# EAGLE design Light-ControllerV3.15 (EAGLE 7.6.0)
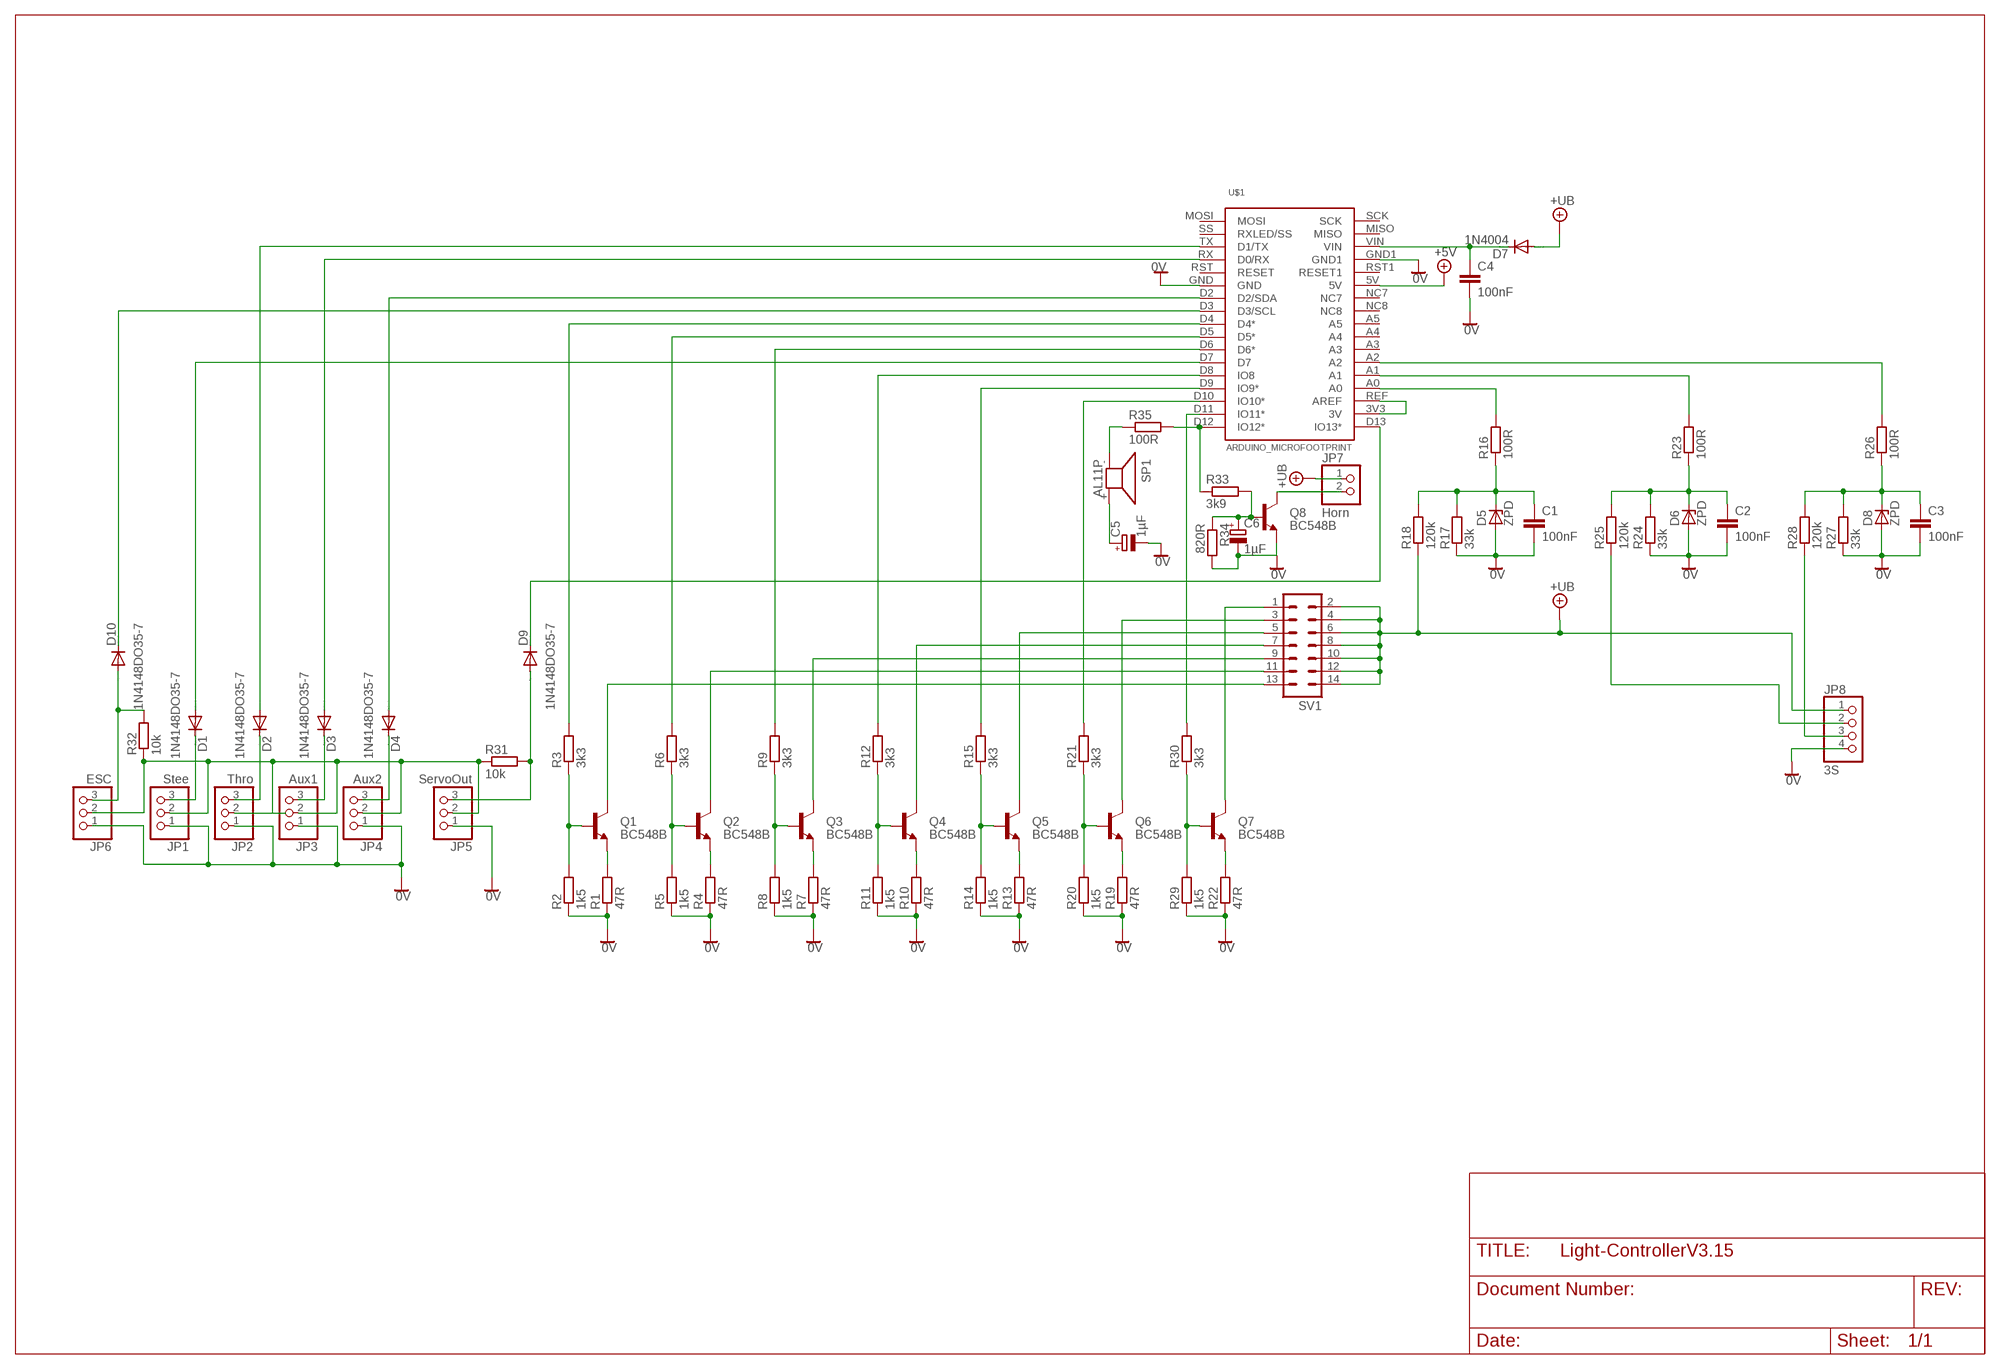
[diagram p0: schematic, sheet 1]

## Parts
C1  100nF  C-EU050-024X044  [C050-024X044]
C2  100nF  C-EU050-024X044  [C050-024X044]
C3  100nF  C-EU050-024X044  [C050-024X044]
C4  100nF  C-EU050-024X044  [C050-024X044]
C5  1µF  CPOL-EUE5-4  [E5-4]
C6  1µF  CPOL-EUE2.5-5  [E2,5-5]
D1  1N4148DO35-7  [DO35-7]
D2  1N4148DO35-7  [DO35-7]
D3  1N4148DO35-7  [DO35-7]
D4  1N4148DO35-7  [DO35-7]
D5  ZPD  [DO35Z10]
D6  ZPD  [DO35Z10]
D7  1N4004  [DO41-10]
D8  ZPD  [DO35Z10]
D9  1N4148DO35-7  [DO35-7]
D10  1N4148DO35-7  [DO35-7]
JP1  Stee  PINHD-1X3  [1X03]
JP2  Thro  PINHD-1X3  [1X03]
JP3  Aux1  PINHD-1X3  [1X03]
JP4  Aux2  PINHD-1X3  [1X03]
JP5  ServoOut  PINHD-1X3  [1X03]
JP6  ESC  PINHD-1X3  [1X03]
JP7  Horn  PINHD-1X2  [1X02]
JP8  3S  PINHD-1X4  [1X04]
Q1  BC548B  [TO92-EBC]
Q2  BC548B  [TO92-EBC]
Q3  BC548B  [TO92-EBC]
Q4  BC548B  [TO92-EBC]
Q5  BC548B  [TO92-EBC]
Q6  BC548B  [TO92-EBC]
Q7  BC548B  [TO92-EBC]
Q8  BC548B  [TO92-EBC]
R1  47R  R-EU_0204/2V  [0204V]
R2  1k5  R-EU_0204/2V  [0204V]
R3  3k3  R-EU_0204/2V  [0204V]
R4  47R  R-EU_0204/2V  [0204V]
R5  1k5  R-EU_0204/2V  [0204V]
R6  3k3  R-EU_0204/2V  [0204V]
R7  47R  R-EU_0204/2V  [0204V]
R8  1k5  R-EU_0204/2V  [0204V]
R9  3k3  R-EU_0204/2V  [0204V]
R10  47R  R-EU_0204/2V  [0204V]
R11  1k5  R-EU_0204/2V  [0204V]
R12  3k3  R-EU_0204/2V  [0204V]
R13  47R  R-EU_0204/2V  [0204V]
R14  1k5  R-EU_0204/2V  [0204V]
R15  3k3  R-EU_0204/2V  [0204V]
R16  100R  R-EU_0204/7  [0204/7]
R17  33k  R-EU_0204/7  [0204/7]
R18  120k  R-EU_0204/7  [0204/7]
R19  47R  R-EU_0204/2V  [0204V]
R20  1k5  R-EU_0204/2V  [0204V]
R21  3k3  R-EU_0204/2V  [0204V]
R22  47R  R-EU_0204/2V  [0204V]
R23  100R  R-EU_0204/7  [0204/7]
R24  33k  R-EU_0204/7  [0204/7]
R25  120k  R-EU_0204/7  [0204/7]
R26  100R  R-EU_0204/7  [0204/7]
R27  33k  R-EU_0204/7  [0204/7]
R28  120k  R-EU_0204/7  [0204/7]
R29  1k5  R-EU_0204/2V  [0204V]
R30  3k3  R-EU_0204/2V  [0204V]
R31  10k  R-EU_0204/2V  [0204V]
R32  10k  R-EU_0204/2V  [0204V]
R33  3k9  R-EU_0204/7  [0204/7]
R34  820R  R-EU_0204/7  [0204/7]
R35  100R  R-EU_0204/7  [0204/7]
SP1  AL11P  [AL11P]
SV1  ML14  [ML14]
U$1  ARDUINO_MICROFOOTPRINT  [ARDUINO-MICRO]

## Nets
0V: C1.2 C2.2 C3.2 C4.2 C5.- C6.- D5.A D6.A D8.A JP1.1 JP2.1 JP3.1 JP4.1 JP5.1 JP6.1 JP8.4 Q8.E R1.1 R2.1 R4.1 R5.1 R7.1 R8.1 R10.1 R11.1 R13.1 R14.1 R17.1 R19.1 R20.1 R22.1 R24.1 R27.1 R29.1 R34.2 U$1.GND U$1.GND1
+5V: U$1.5V
+UB: D7.A JP7.1 JP8.1 R18.1 SV1.2 SV1.4 SV1.6 SV1.8 SV1.10 SV1.12 SV1.14
+UB1: JP8.2 R25.1
+UB2: JP8.3 R28.1
N$1: Q1.B R2.2 R3.1
N$2: D1.C JP1.3
N$3: Q1.E R1.2
N$4: Q2.B R5.2 R6.1
N$5: Q2.E R4.2
N$6: Q3.B R8.2 R9.1
N$7: Q3.E R7.2
N$8: Q4.B R11.2 R12.1
N$9: Q4.E R10.2
N$10: Q5.B R14.2 R15.1
N$11: Q5.E R13.2
N$12: Q1.C SV1.13
N$13: Q2.C SV1.11
N$14: Q3.C SV1.9
N$15: Q4.C SV1.7
N$16: Q5.C SV1.5
N$17: U$1.3V3(3V) U$1.REF(AREF)
N$18: D2.C JP2.3
N$19: D3.C JP3.3
N$20: D4.C JP4.3
N$21: D1.A U$1.D7
N$22: JP1.2 JP2.2 JP3.2 JP4.2 JP5.2 JP6.2 R31.1 R32.1
N$23: D2.A U$1.TX(D1/TX)
N$24: D3.A U$1.RX(D0/RX)
N$25: D4.A U$1.D2(D2/SDA)
N$26: R3.2 U$1.D4(D4*)
N$27: R6.2 U$1.D5(D5*)
N$28: R9.2 U$1.D6(D6*)
N$29: R12.2 U$1.D8(IO8)
N$30: R15.2 U$1.D9(IO9*)
N$31: R16.2 U$1.A0
N$32: C1.1 D5.C R16.1 R17.2 R18.2
N$33: Q6.B R20.2 R21.1
N$34: Q6.E R19.2
N$35: R21.2 U$1.D10(IO10*)
N$36: R30.2 U$1.D11(IO11*)
N$37: Q7.B R29.2 R30.1
N$38: Q7.E R22.2
N$39: R23.2 U$1.A1
N$40: C2.1 D6.C R23.1 R24.2 R25.2
N$41: Q6.C SV1.3
N$42: C4.1 D7.C U$1.VIN
N$43: Q7.C SV1.1
N$44: R26.2 U$1.A2
N$45: C3.1 D8.C R26.1 R27.2 R28.2
N$46: R33.1 R35.2 U$1.D12(IO12*)
N$47: D9.A JP5.3 R31.2
N$48: D9.C U$1.D13(IO13*)
N$49: D10.A JP6.3 R32.2
N$50: D10.C U$1.D3(D3/SCL)
N$51: C6.+ Q8.B R33.2 R34.1
N$52: JP7.2 Q8.C
N$53: R35.1 SP1.-
N$54: C5.+ SP1.+
Unconnected: U$1.A3 U$1.A4 U$1.A5 U$1.MISO U$1.MOSI U$1.NC7 U$1.NC8 U$1.RST1(RESET1) U$1.RST(RESET) U$1.SCK U$1.SS(RXLED/SS)

## Library data of the parts
C1-C4 = rcl:C-EU: CAPACITOR, European symbol
C5 C6 = rcl:CPOL-EU: POLARIZED CAPACITOR, European symbol
D1-D4 D9 D10 = diode:1N4148: DIODE high speed (Philips)
D5 D6 D8 = diode:ZPD: Z DIODE 500 mW
D7 = diode:1N4004: DIODE general purpose rectifier, 1 A
JP1-JP6 = pinhead:PINHD-1X3: PIN HEADER
JP7 = pinhead:PINHD-1X2: PIN HEADER
JP8 = pinhead:PINHD-1X4: PIN HEADER
Q1-Q8 = transistor-npn:BC548*: NPN Transistor
R1-R35 = rcl:R-EU_: RESISTOR, European symbol
SP1 = buzzer:AL11P: SPEAKER Source: Buerklin; OC_FARNELL: unknown; OC_NEWARK: unknown
SV1 = con-harting-ml:ML14: HARTING; OC_FARNELL: unknown; OC_NEWARK: unknown
U$1 = arduino-micro:ARDUINO_MICRO

## Board
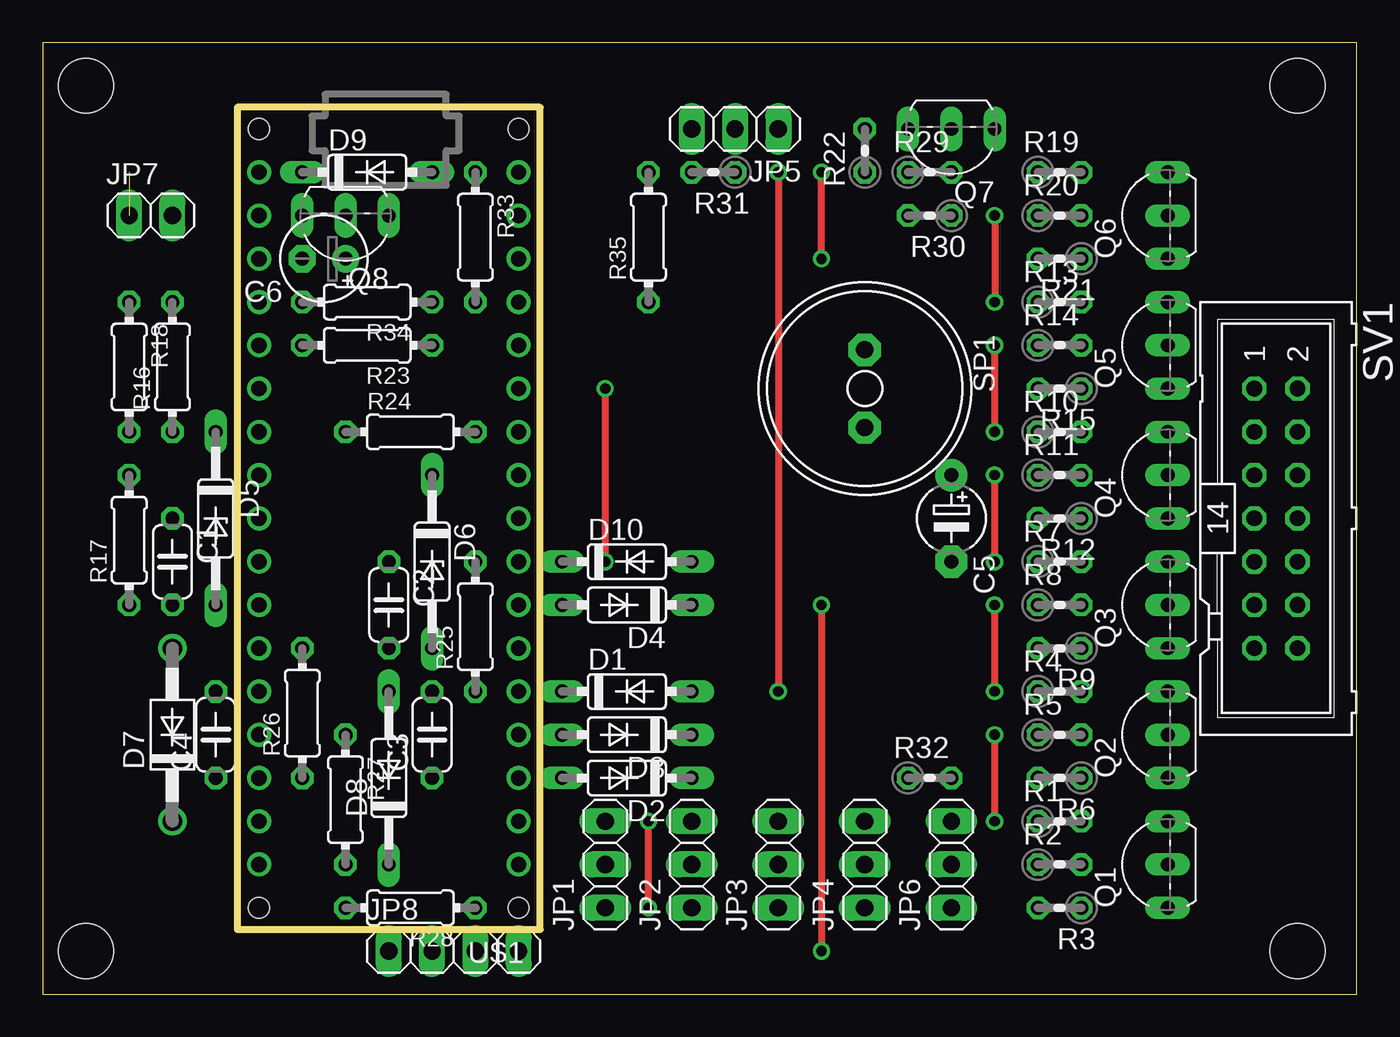
[diagram p1: board, top side]
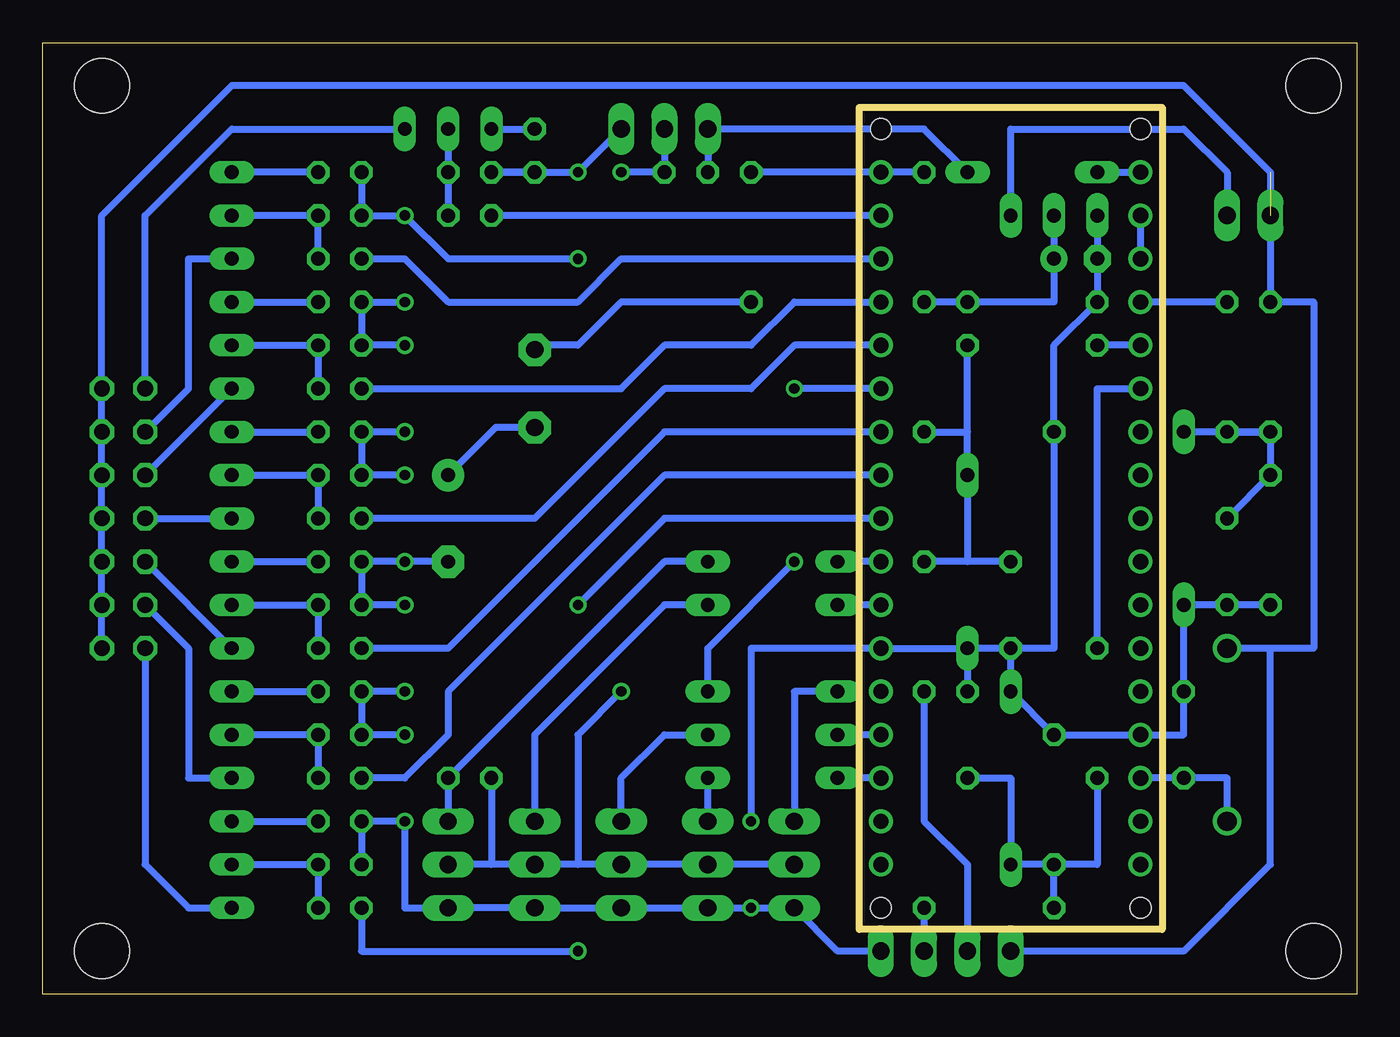
[diagram p2: board, bottom side, seen from below]

Size 77.14 x 55.87 mm. Coordinates in mm from the lower left corner, seen from the top.
Outline: 0,0 77.14,0 77.14,55.87 0,55.87 0,0
Copper layers (1*16): Top 0.035mm / dielectric 1.5mm / Bottom 0.035mm
Design rules "default": minimum track width 10mil, minimum drill 24mil, track to track 8mil, track to pad 8mil, pad to pad 8mil, via to via 8mil, smd to smd 8mil, copper to edge 40mil, drill to drill 8mil, minimum pad ring 10mil, minimum via ring 8mil, stop-mask expansion 4mil, vias tented up to drill 0mil, thermal gap 10mil
Holes 3.2 mm at 2.54,53.34 73.66,53.34 2.54,2.54 73.66,2.54

### Footprints (pad centres in the part's own frame; a part is rotated, then mirrored left to right if it is on the bottom)
C050-024X044 = drill 0.813 octagon: 1 -2.54,0; 2 2.54,0
E5-4 = drill 0.813 pad 1.905: + -2.54,0 | drill 0.813 pad 1.905 octagon: - 2.54,0
E2,5-5 = drill 0.813 pad 1.6: + -1.27,0 | drill 0.813 pad 1.6 octagon: - 1.27,0
DO35-7 = drill 0.813 long: A 3.81,0; C -3.81,0
DO35Z10 = drill 0.813 long: A 5.08,0; C -5.08,0
DO41-10 = drill 1.118: A 5.08,0; C -5.08,0
1X03 = drill 1.016 long: 1 -2.54,0; 2 0,0; 3 2.54,0
1X02 = drill 1.016 long: 1 -1.27,0; 2 1.27,0
1X04 = drill 1.016 long: 1 -3.81,0; 2 -1.27,0; 3 1.27,0; 4 3.81,0
TO92-EBC = drill 0.813 long: B 0,-1.27; C -2.54,-1.27; E 2.54,-1.27
0204V = drill 0.813 octagon: 1 -1.27,0; 2 1.27,0
0204/7 = drill 0.813 octagon: 1 -3.81,0; 2 3.81,0
AL11P = drill 1.016 pad 1.905 octagon: + 2.286,0; - -2.286,0
ML14 = drill 0.914 octagon: 1 -7.62,-1.27; 2 -7.62,1.27; 3 -5.08,-1.27; 4 -5.08,1.27; 5 -2.54,-1.27; 6 -2.54,1.27; 7 0,-1.27; 8 0,1.27; 9 2.54,-1.27; 10 2.54,1.27; 11 5.08,-1.27; 12 5.08,1.27; 13 7.62,-1.27; 14 7.62,1.27
ARDUINO-MICRO = drill 0.9: 3V3 16.51,3.81; 5V 16.51,29.21; A0 16.51,8.89; A1 16.51,11.43; A2 16.51,13.97; A3 16.51,16.51; A4 16.51,19.05; A5 16.51,21.59; D2 1.27,26.67; D3 1.27,24.13; D4 1.27,21.59; D5 1.27,19.05; D6 1.27,16.51; D7 1.27,13.97; D8 1.27,11.43; D9 1.27,8.89; D10 1.27,6.35; D11 1.27,3.81; D12 1.27,1.27; D13 16.51,1.27; GND 1.27,29.21; GND1 16.51,34.29; MISO 16.51,39.37; MOSI 1.27,41.91; NC7 16.51,26.67; NC8 16.51,24.13; REF 16.51,6.35; RST 1.27,31.75; RST1 16.51,31.75; RX 1.27,34.29; SCK 16.51,41.91; SS 1.27,39.37; TX 1.27,36.83; VIN 16.51,36.83 | hole 1.2: 1.27,-1.27; 16.51,-1.27; 1.27,44.45; 16.51,44.45

### Placement (x,y rotation side)
C1  7.62,25.4 270 top
C2  20.32,22.86 270 top
C3  22.86,15.24 90 top
C4  10.16,15.24 90 top
C5  53.34,27.94 270 top
C6  16.51,43.18 180 top
D1  34.29,17.78 0 top
D2  34.29,12.7 180 top
D3  34.29,15.24 180 top
D4  34.29,22.86 180 top
D5  10.16,27.94 270 top
D6  22.86,25.4 270 top
D7  7.62,15.24 90 top
D8  20.32,12.7 90 top
D9  19.05,48.26 0 top
D10  34.29,25.4 0 top
JP1  33.02,7.62 90 top
JP2  38.1,7.62 90 top
JP3  43.18,7.62 90 top
JP4  48.26,7.62 90 top
JP5  40.64,50.8 180 top
JP6  ESCout  [1X03]  53.34,7.62 90 top
JP7  6.35,45.72 0 top
JP8  24.13,2.54 0 top
Q1  64.77,7.62 90 top
Q2  64.77,15.24 90 top
Q3  64.77,22.86 90 top
Q4  64.77,30.48 90 top
Q5  64.77,38.1 90 top
Q6  64.77,45.72 90 top
Q7  53.34,49.53 180 top
Q8  17.78,44.45 180 top
R1  59.69,10.16 0 top
R2  59.69,7.62 0 top
R3  59.69,5.08 180 top
R4  59.69,17.78 0 top
R5  59.69,15.24 0 top
R6  59.69,12.7 180 top
R7  59.69,25.4 0 top
R8  59.69,22.86 0 top
R9  59.69,20.32 180 top
R10  59.69,33.02 0 top
R11  59.69,30.48 0 top
R12  59.69,27.94 180 top
R13  59.69,40.64 0 top
R14  59.69,38.1 0 top
R15  59.69,35.56 180 top
R16  7.62,36.83 90 top
R17  5.08,26.67 90 top
R18  5.08,36.83 270 top
R19  59.69,48.26 0 top
R20  59.69,45.72 0 top
R21  59.69,43.18 180 top
R22  48.26,49.53 90 top
R23  19.05,38.1 180 top
R24  21.59,33.02 0 top
R25  25.4,21.59 90 top
R26  15.24,16.51 90 top
R27  17.78,11.43 270 top
R28  21.59,5.08 180 top
R29  52.07,48.26 0 top
R30  52.07,45.72 180 top
R31  39.37,48.26 180 top
R32  52.07,12.7 0 top
R33  25.4,44.45 270 top
R34  19.05,40.64 180 top
R35  35.56,44.45 90 top
SP1  48.26,35.56 270 top
SV1  Light  [ML14]  72.39,27.94 270 top
U$1  29.21,49.53 180 top

### Tracks (layer width: path | path; a pad name or v marks a point on that pad's centre or on a via)
0V  (via drill 0.6)
  Top 0.406: v55.88,10.16 v55.88,15.24 | v55.88,17.78 v55.88,22.86 | v55.88,25.4 v55.88,30.48 | v55.88,33.02 v55.88,38.1 | v55.88,45.72 v55.88,40.64 | v45.72,43.18 v45.72,48.26 | v35.56,5.08 v35.56,10.16
  Bottom 0.406: R2.1 R1.1 v55.88,10.16 55.88,5.08 JP6.1 JP4.1 JP3.1 JP2.1 v35.56,5.08 JP1.1 30.48,2.54 JP8.4 | v55.88,38.1 R14.1 R13.1 v55.88,40.64 | v55.88,33.02 R10.1 R11.1 v55.88,30.48 | v55.88,22.86 R8.1 R7.1 v55.88,25.4 C5.- | v55.88,17.78 R4.1 R5.1 v55.88,15.24 | R17.1 C1.2 D5.A C4.2 10.16,15.24 U$1.GND1 R27.1 D8.A C2.2 | C2.2 D6.A | D6.A C3.2 | R22.1 R29.1 v45.72,48.26 JP5.1 | R19.1 R20.1 v55.88,45.72 53.34,43.18 v45.72,43.18 | v35.56,10.16 35.56,20.32 U$1.GND D6.A | C2.2 17.78,20.32 R24.1 17.78,38.1 R34.2 C6.- Q8.E
+UB  (1 unrouted)
  Bottom 0.406: 5.08,20.32 2.54,20.32 2.54,40.64 R18.1 5.08,48.26 10.16,53.34 66.04,53.34 73.66,45.72 SV1.2 SV1.4 SV1.6 SV1.8 SV1.10 SV1.12 SV1.14 | 5.08,20.32 D7.A | 5.08,20.32 5.08,7.62 10.16,2.54 JP8.1
+UB1
  Bottom 0.406: R25.1 25.4,10.16 22.86,7.62 JP8.2
+UB2
  Bottom 0.406: R28.1 JP8.3
N$1
  Bottom 0.406: R3.1 R2.2 Q1.B
N$2
  Bottom 0.406: D1.C 33.02,17.78 JP1.3
N$3
  Bottom 0.406: Q1.E R1.2
N$4
  Bottom 0.406: Q2.B R5.2 R6.1
N$5
  Bottom 0.406: Q2.E R4.2
N$6
  Bottom 0.406: Q3.B R8.2 R9.1
N$7
  Bottom 0.406: Q3.E R7.2
N$8
  Bottom 0.406: Q4.B R11.2 R12.1
N$9
  Bottom 0.406: Q4.E R10.2
N$10
  Bottom 0.406: Q5.B R14.2 R15.1
N$11
  Bottom 0.406: Q5.E R13.2
N$12
  Bottom 0.406: SV1.13 71.12,7.62 68.58,5.08 Q1.C
N$13
  Bottom 0.406: SV1.11 68.58,20.32 68.58,12.7 Q2.C
N$14
  Bottom 0.406: SV1.9 Q3.C
N$15
  Bottom 0.406: SV1.7 Q4.C
N$16
  Bottom 0.406: SV1.5 Q5.C
N$17
  Bottom 0.406: U$1.3V3 U$1.REF
N$18
  Bottom 0.406: JP2.3 D2.C
N$19
  Bottom 0.406: JP3.3 43.18,12.7 40.64,15.24 D3.C
N$20
  Bottom 0.406: D4.C 40.64,22.86 48.26,15.24 JP4.3
N$21  (via drill 0.6)
  Top 0.406: v33.02,35.56 v33.02,25.4
  Bottom 0.406: U$1.D7 v33.02,35.56 | D1.A 38.1,20.32 v33.02,25.4
N$22  (via drill 0.6)
  Top 0.406: v43.18,48.26 v43.18,17.78
  Bottom 0.406: JP1.2 JP2.2 JP3.2 45.72,7.62 | 45.72,7.62 JP4.2 50.8,7.62 | JP5.2 R31.1 v43.18,48.26 | 50.8,7.62 JP6.2 | R32.1 50.8,7.62 | v43.18,17.78 45.72,15.24 45.72,7.62
N$23
  Bottom 0.406: U$1.TX D2.A
N$24
  Bottom 0.406: U$1.RX D3.A
N$25
  Bottom 0.406: U$1.D2 D4.A
N$26  (via drill 0.6)
  Top 0.406: v45.72,22.86 v45.72,2.54
  Bottom 0.406: U$1.D4 40.64,27.94 v45.72,22.86 | R3.2 58.42,2.54 v45.72,2.54
N$27
  Bottom 0.406: U$1.D5 40.64,30.48 53.34,17.78 53.34,15.24 55.88,12.7 R6.2
N$28
  Bottom 0.406: U$1.D6 40.64,33.02 53.34,20.32 R9.2
N$29
  Bottom 0.406: U$1.D8 33.02,38.1 35.56,35.56 40.64,35.56 48.26,27.94 R12.2
N$30
  Bottom 0.406: R15.2 43.18,35.56 40.64,38.1 35.56,38.1 33.02,40.64 U$1.D9
N$31
  Bottom 0.406: R16.2 U$1.A0
N$32
  Bottom 0.406: R16.1 R18.2 | R18.2 D5.C | C1.1 R17.2 R18.2
N$33
  Bottom 0.406: Q6.B R20.2 R21.1
N$34
  Bottom 0.406: R19.2 Q6.E
N$35
  Bottom 0.406: R21.2 55.88,43.18 53.34,40.64 45.72,40.64 43.18,43.18 U$1.D10
N$36
  Bottom 0.406: U$1.D11 R30.2
N$37
  Bottom 0.406: Q7.B R29.2 R30.1
N$38
  Bottom 0.406: Q7.E R22.2
N$39
  Bottom 0.406: U$1.A1 R23.2
N$40
  Bottom 0.406: C2.1 22.86,25.4 | 22.86,25.4 R25.2 | 22.86,25.4 D6.C 22.86,33.02 | 22.86,33.02 R23.1 | R24.2 22.86,33.02
N$41
  Bottom 0.406: SV1.3 68.58,35.56 68.58,43.18 Q6.C
N$42
  Bottom 0.406: D7.C 7.62,12.7 C4.1 U$1.VIN
N$43
  Bottom 0.406: SV1.1 71.12,45.72 66.04,50.8 Q7.C
N$44
  Bottom 0.406: R26.2 15.24,35.56 U$1.A2
N$45
  Bottom 0.406: R26.1 15.24,7.62 R27.2 | R27.2 D8.C 20.32,12.7 C3.1 | R28.2 R27.2
N$46
  Bottom 0.406: U$1.D12 R33.1 R35.2
N$47
  Bottom 0.406: D9.A 25.4,50.8 JP5.3 R31.2
N$48
  Bottom 0.406: D9.C U$1.D13
N$49
  Bottom 0.406: JP6.3 R32.2 40.64,25.4 D10.A
N$50
  Bottom 0.406: U$1.D3 D10.C
N$51
  Bottom 0.406: R33.2 R34.1 17.78,40.64 C6.+ Q8.B
N$52
  Bottom 0.406: JP7.2 7.62,48.26 10.16,50.8 20.32,50.8 Q8.C
N$53
  Bottom 0.406: R35.1 43.18,40.64 45.72,38.1 48.01,38.1 SP1.-
N$54
  Bottom 0.406: SP1.+ 50.55,33.27 C5.+